# Altium schematic sheet 012_AdditionalFunction.SchDoc
size A4; Organization: OLTEST; Revision: 01; SheetNumber: 12; SheetTotal: 12; Название листа: Название листа; Разработчик: Бондарчук С.; Прибор: R100; АМАК.000000.000 Э3: R100.220.040.000 Э3; Дата: 30.01.2017; Формат: A4
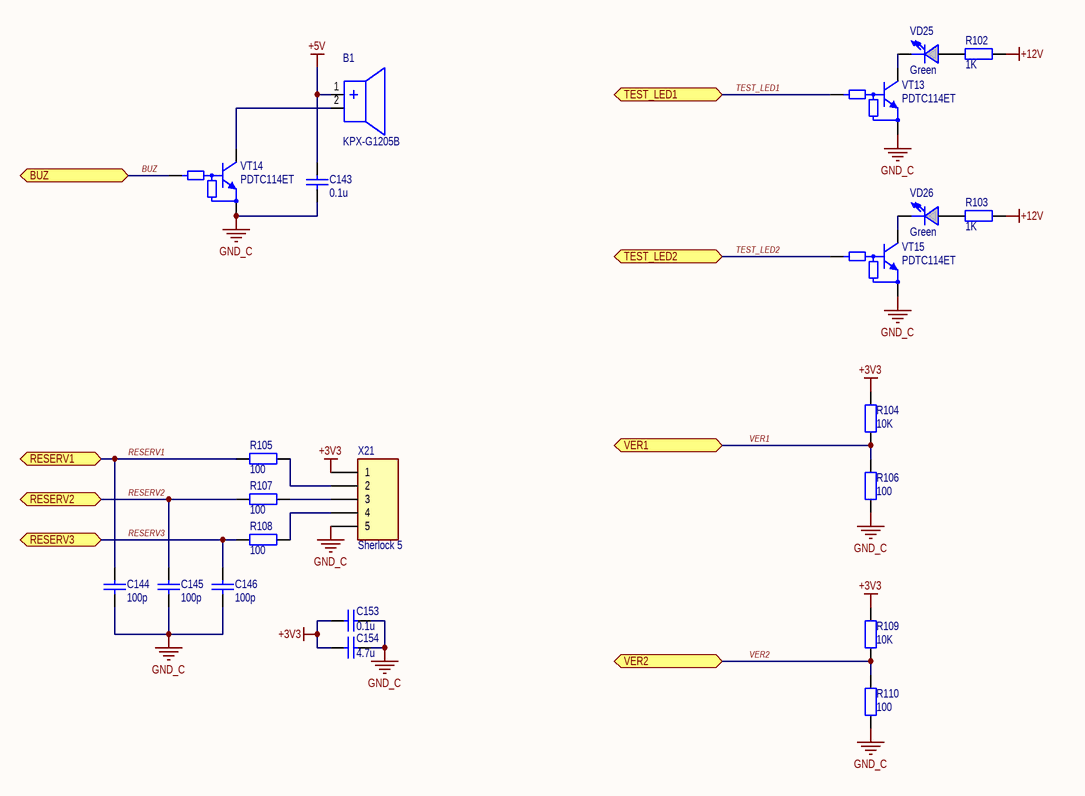
[diagram p0: 012_AdditionalFunction.SchDoc]

## Parts
B1  KPX-G1205B  [KPX-G12]
C143  0.1u  [SMD_C_0603]
C144  100p  [SMD_C_0603]
C145  100p  [SMD_C_0603]
C146  100p  [SMD_C_0603]
C153  0.1u  [SMD_C_0603]
C154  4.7u  [SMD_C_0805]
R102  1K  [SMD_R_1206]
R103  1K  [SMD_R_1206]
R104  10K  [SMD_R_0603]
R105  100  [SMD_R_0603]
R106  100  [SMD_R_0603]
R107  100  [SMD_R_0603]
R108  100  [SMD_R_0603]
R109  10K  [SMD_R_0603]
R110  100  [SMD_R_0603]
VD25  value Green  [SMD_LED_LL_Green]  (hidden comment: LL-S172GC-2A)
VD26  value Green  [SMD_LED_LL_Green]  (hidden comment: LL-S172GC-2A)
VT13  PDTC114ET  [SOT23-3]
VT14  PDTC114ET  [SOT23-3]
VT15  PDTC114ET  [SOT23-3]
X21  Sherlock 5  [35362-0550]

## Ports
BUZ, RESERV1, RESERV2, RESERV3, TEST_LED1, TEST_LED2, VER1, VER2

## Nets
+3V3: C153.1 C154.1 R104.2 R109.2 X21.1
+5V: B1.1(+) C143.2
+12V: R102.2 R103.2
GND_C: C143.1 C144.1 C145.1 C146.1 C153.2 C154.2 R106.1 R110.1 VT13.2(E) VT14.2(E) VT15.2(E) X21.5
BUZ: VT14.1(B) ; port BUZ
RESERV1: C144.2 R105.1 ; port RESERV1
RESERV2: C145.2 R107.1 ; port RESERV2
RESERV3: C146.2 R108.1 ; port RESERV3
TEST_LED1: VT13.1(B) ; port TEST_LED1
TEST_LED2: VT15.1(B) ; port TEST_LED2
VER1: R104.1 R106.2 ; port VER1
VER2: R109.1 R110.2 ; port VER2
NetB1_2: B1.2(-) VT14.3(C)
NetR102_1: R102.1 VD25.1(ANODE)
NetR103_1: R103.1 VD26.1(ANODE)
NetR105_2: R105.2 X21.2
NetR107_2: R107.2 X21.3
NetR108_2: R108.2 X21.4
NetVD25_2: VD25.2(CATHODE) VT13.3(C)
NetVD26_2: VD26.2(CATHODE) VT15.3(C)

## Notes on the sheet
- Разработчик:
- Формат:
- Rev.:
- Лист
- Дата:
- Листов
- WorkSpace:
- Дата изм.:

## Library data of the parts
B1 = KPX-G1205B: Magnetic Buzzer; Manufacturer: KEPO; PartNumber: KPX-G1205B
C143 C153 = C0603 0.1u 50V 10%: SMD C 0603 MURATA 50V 10% X7R; PartNumber: GRM188R71H104K; Manufacturer: MURATA; Value: 0.1u
C144-C146 = C0603 100p 100V 5%: SMD C 0603 MURATA 100V 5% NP0; PartNumber: GRM1885C2A101JA01; Manufacturer: MURATA; Value: 100p
C154 = C0805 4.7u 25V 20%  X5R: SMD C 0805 MURATA 50V 5% NP0; PartNumber: GRM21BR61E475M; Manufacturer: MURATA; Value: 4.7u
R102 R103 = R1206 1K 1%: SMD R 1206 VISHAY 0.25W 200V 1% 100ppm; PartNumber: CRCW12061K00FK; Manufacturer: VISHAY; Value: 1K
R104 R109 = R0603 10К 1%: SMD R 0603 VISHAY 0.1W 75V 1% 100ppm; PartNumber: CRCW060310K0FK; Manufacturer: VISHAY; Value: 10K
R105-R108 R110 = R0603 100 1%: SMD R 0603 VISHAY 0.1W 75V 1% 100ppm; PartNumber: CRCW0603100RFK; Manufacturer: VISHAY; Value: 100
VD25 VD26 = LL-S172GC-2A: LED Green SMD; Manufacturer: Lucky Light; PartNumber: LL-S172GC-2A
VT13-VT15 = PDTC114ET: Digital Transistor (BRT), R1=10 kOhm, R2=10 kOhm, NPN Transistor; Manufacturer: On Semiconductor; PartNumber: PDTC114ET
X21 = 35362-0550: Sherlock 5 Top, 2A 125V 2mm; Manufacturer: MOLEX; PartNumber: 35362-0550